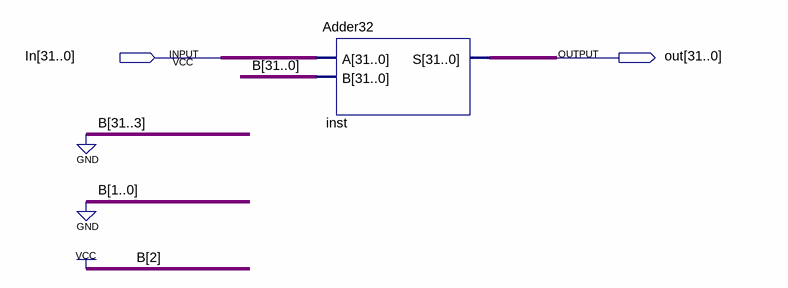
[diagram p0: schematic sheet]
// Quartus schematic plusFour32.bdf as structural Verilog: 1 symbols, 2 pins
module plusFour32 (
  input  [31:0] In,
  output [31:0] out
);

  Adder32 inst (.A(In), .B(32'b00000000000000000000000000000100), .S(out));
endmodule
